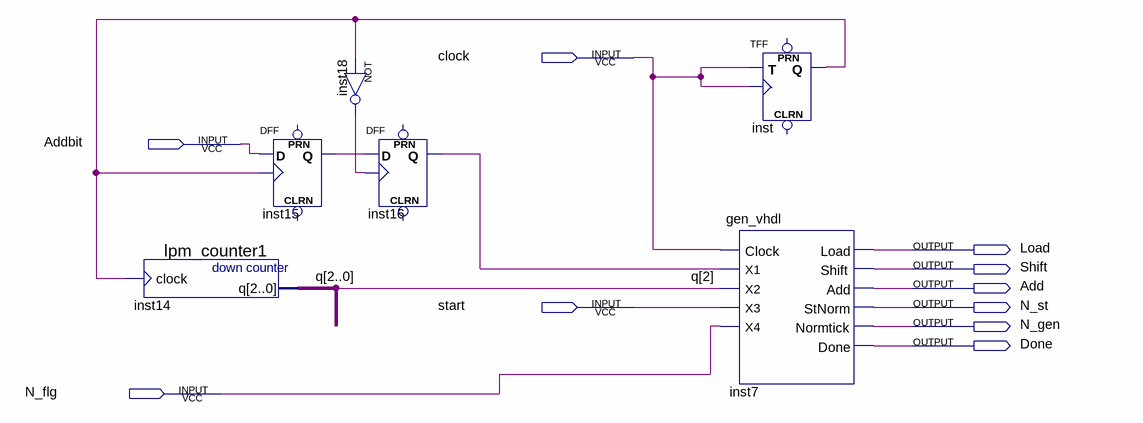
[diagram p0: schematic sheet]
// Quartus schematic generator.bdf as structural Verilog: 6 symbols, 10 pins
module generator (
  input  clock,
  input  Addbit,
  input  start,
  input  N_flg,
  output Load,
  output Shift,
  output Add,
  output N_st,
  output N_gen,
  output Done
);

  wire inst15_q, inst16_q, inst18_out, inst_q;
  wire [2:0] q;

  lpm_counter1 inst14 (.clock(inst_q), .q(q));
  DFF inst15 (.CLK(inst_q), .D(Addbit), .Q(inst15_q));  // open: CLRN, PRN
  not inst18 (inst18_out, inst_q);
  DFF inst16 (.CLK(inst18_out), .D(inst15_q), .Q(inst16_q));  // open: CLRN, PRN
  TFF inst (.T(clock), .CLK(clock), .Q(inst_q));  // open: PRN, CLRN
  gen_vhdl inst7 (
    .Clock(clock), .X1(inst16_q), .X2(q[2]), .X3(start), .X4(N_flg), .Load(Load), .Shift(Shift), .Add(Add),
    .StNorm(N_st), .Normtick(N_gen), .Done(Done));
endmodule
